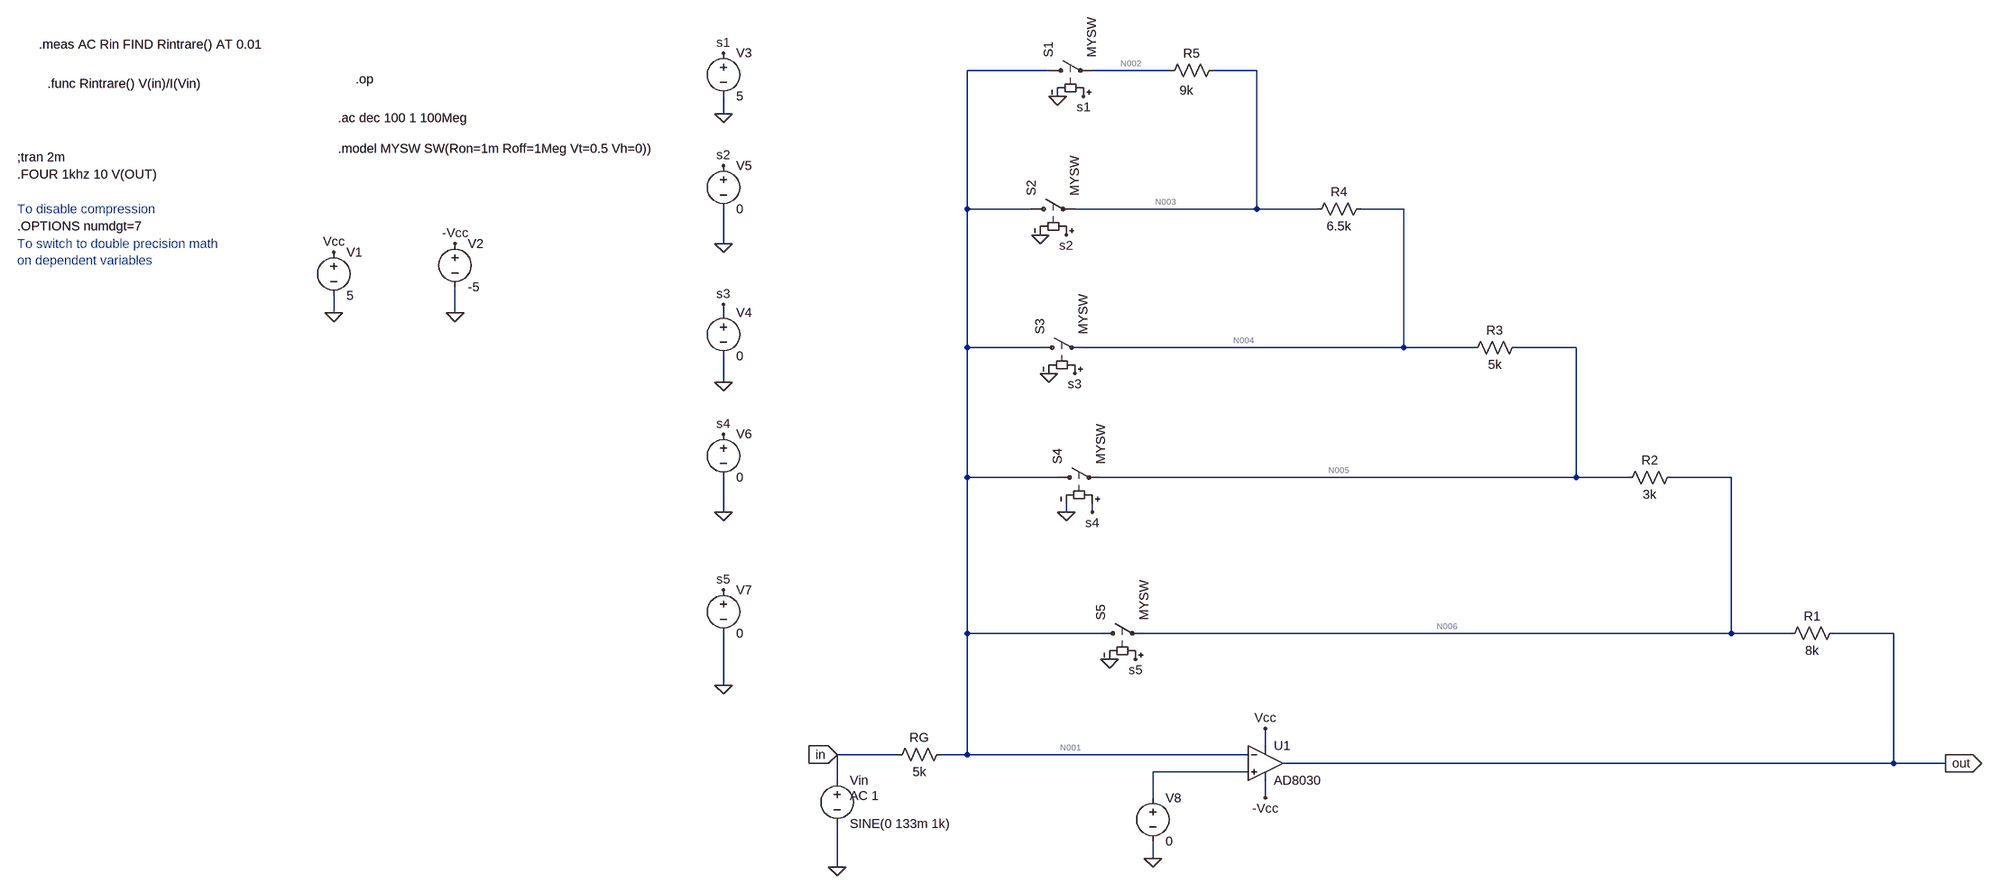
[diagram p0: schematic etaj3_.asc]
etaj3_.asc, the LTspice schematic file:
Version 4
SHEET 1 880 888
WIRE -1808 -5536 -2096 -5536
WIRE -1584 -5536 -1728 -5536
WIRE -1424 -5536 -1504 -5536
WIRE -2656 -5456 -2656 -5488
WIRE -2096 -5280 -2096 -5536
WIRE -1840 -5280 -2096 -5280
WIRE -1424 -5280 -1424 -5536
WIRE -1424 -5280 -1760 -5280
WIRE -1312 -5280 -1424 -5280
WIRE -1152 -5280 -1232 -5280
WIRE -2656 -5216 -2656 -5280
WIRE -3616 -5088 -3616 -5120
WIRE -3392 -5088 -3392 -5136
WIRE -2656 -5088 -2656 -5104
WIRE -2096 -5024 -2096 -5280
WIRE -1824 -5024 -2096 -5024
WIRE -1152 -5024 -1152 -5280
WIRE -1152 -5024 -1744 -5024
WIRE -1024 -5024 -1152 -5024
WIRE -832 -5024 -944 -5024
WIRE -2656 -4960 -2656 -5008
WIRE -2096 -4784 -2096 -5024
WIRE -1792 -4784 -2096 -4784
WIRE -832 -4784 -832 -5024
WIRE -832 -4784 -1712 -4784
WIRE -736 -4784 -832 -4784
WIRE -512 -4784 -656 -4784
WIRE -2656 -4720 -2656 -4784
WIRE -1776 -4720 -1776 -4736
WIRE -1728 -4720 -1728 -4736
WIRE -2096 -4496 -2096 -4784
WIRE -1712 -4496 -2096 -4496
WIRE -512 -4496 -512 -4784
WIRE -512 -4496 -1632 -4496
WIRE -336 -4496 -512 -4496
WIRE -96 -4496 -256 -4496
WIRE -2656 -4400 -2656 -4496
WIRE -1408 -4288 -1408 -4320
WIRE -2224 -4272 -2336 -4272
WIRE -2096 -4272 -2096 -4496
WIRE -2096 -4272 -2144 -4272
WIRE -1440 -4272 -2096 -4272
WIRE -96 -4256 -96 -4496
WIRE -96 -4256 -1376 -4256
WIRE 0 -4256 -96 -4256
WIRE -1440 -4240 -1616 -4240
WIRE -2336 -4224 -2336 -4272
WIRE -1616 -4192 -1616 -4240
WIRE -1408 -4192 -1408 -4224
WIRE -1616 -4080 -1616 -4112
WIRE -2336 -4064 -2336 -4144
FLAG -2336 -4064 0
FLAG -3616 -5088 0
FLAG -3392 -5088 0
FLAG -3392 -5216 -Vcc
FLAG -3616 -5200 Vcc
FLAG -2656 -5456 0
FLAG -2656 -4720 0
FLAG -2656 -4400 0
FLAG -2656 -5216 0
FLAG -2656 -5568 s1
FLAG -2656 -5360 s2
FLAG -2656 -5104 s3
FLAG -2656 -4864 s4
FLAG -2656 -4576 s5
FLAG -2656 -4960 0
FLAG -1792 -5488 0
FLAG -1744 -5488 s1
FLAG -1824 -5232 0
FLAG -1776 -5232 s2
FLAG -1808 -4976 0
FLAG -1760 -4976 s3
FLAG -1776 -4720 0
FLAG -1728 -4720 s4
FLAG -1696 -4448 0
FLAG -1648 -4448 s5
FLAG 0 -4256 out
IOPIN 0 -4256 Out
FLAG -1408 -4320 Vcc
FLAG -1408 -4192 -Vcc
FLAG -2336 -4272 in
IOPIN -2336 -4272 In
FLAG -1616 -4080 0
SYMBOL res -1488 -5552 R90
WINDOW 0 0 56 VBottom 2
WINDOW 3 37 66 VTop 2
SYMATTR InstName R5
SYMATTR Value 9k
SYMBOL res -1216 -5296 R90
WINDOW 0 0 56 VBottom 2
WINDOW 3 32 56 VTop 2
SYMATTR InstName R4
SYMATTR Value 6.5k
SYMBOL res -928 -5040 R90
WINDOW 0 0 56 VBottom 2
WINDOW 3 32 56 VTop 2
SYMATTR InstName R3
SYMATTR Value 5k
SYMBOL res -640 -4800 R90
WINDOW 0 0 56 VBottom 2
WINDOW 3 32 56 VTop 2
SYMATTR InstName R2
SYMATTR Value 3k
SYMBOL res -240 -4512 R90
WINDOW 0 0 56 VBottom 2
WINDOW 3 32 56 VTop 2
SYMATTR InstName R1
SYMATTR Value 8k
SYMBOL res -2128 -4288 R90
WINDOW 0 0 56 VBottom 2
WINDOW 3 32 56 VTop 2
SYMATTR InstName RG
SYMATTR Value 5k
SYMBOL voltage -2336 -4240 R0
WINDOW 123 24 44 Left 2
WINDOW 39 0 0 Left 0
SYMATTR Value2 AC 1
SYMATTR InstName Vin
SYMATTR Value SINE(0 133m 1k)
SYMBOL voltage -3616 -5216 R0
WINDOW 123 0 0 Left 0
WINDOW 39 0 0 Left 0
SYMATTR InstName V1
SYMATTR Value 5
SYMBOL voltage -3392 -5232 R0
WINDOW 123 0 0 Left 0
WINDOW 39 0 0 Left 0
SYMATTR InstName V2
SYMATTR Value -5
SYMBOL voltage -2656 -5584 R0
WINDOW 123 0 0 Left 0
WINDOW 39 0 0 Left 0
SYMATTR InstName V3
SYMATTR Value 5
SYMBOL voltage -2656 -5104 R0
WINDOW 123 0 0 Left 0
WINDOW 39 0 0 Left 0
SYMATTR InstName V4
SYMATTR Value 0
SYMBOL voltage -2656 -5376 R0
WINDOW 123 0 0 Left 0
WINDOW 39 0 0 Left 0
SYMATTR InstName V5
SYMATTR Value 0
SYMBOL voltage -2656 -4880 R0
WINDOW 123 0 0 Left 0
WINDOW 39 0 0 Left 0
SYMATTR InstName V6
SYMATTR Value 0
SYMBOL voltage -2656 -4592 R0
WINDOW 123 0 0 Left 0
WINDOW 39 0 0 Left 0
SYMATTR InstName V7
SYMATTR Value 0
SYMBOL sw -1824 -5536 R270
SYMATTR InstName S1
SYMATTR Value MYSW
SYMBOL sw -1856 -5280 R270
SYMATTR InstName S2
SYMATTR Value MYSW
SYMBOL sw -1840 -5024 R270
SYMATTR InstName S3
SYMATTR Value MYSW
SYMBOL sw -1808 -4784 R270
SYMATTR InstName S4
SYMATTR Value MYSW
SYMBOL sw -1728 -4496 R270
SYMATTR InstName S5
SYMATTR Value MYSW
SYMBOL OpAmps\\AD8030 -1408 -4320 R0
SYMATTR InstName U1
SYMBOL voltage -1616 -4208 R0
WINDOW 123 0 0 Left 0
WINDOW 39 0 0 Left 0
SYMATTR InstName V8
SYMATTR Value 0
TEXT -3608 -5448 Left 2 !.ac dec 100 1 100Meg
TEXT -3608 -5392 Left 2 !.model MYSW SW(Ron=1m Roff=1Meg Vt=0.5 Vh=0))
TEXT -3576 -5520 Left 2 !.op
TEXT -5024 -5584 Left 2 !.meas AC Rin FIND Rintrare() AT 0.01
TEXT -5008 -5512 Left 2 !.func Rintrare() V(in)/I(Vin)
TEXT -5064 -5376 Left 2 !;tran 2m
TEXT -5064 -5280 Left 2 ;To disable compression
TEXT -5064 -5248 Left 2 !.OPTIONS numdgt=7
TEXT -5064 -5216 Left 2 ;To switch to double precision math\non dependent variables
TEXT -5064 -5344 Left 2 !.FOUR 1khz 10 V(OUT)

The netlist it stands for:
* etaj3_.asc
R5 N003 N002 9k
R4 N004 N003 6.5k
R3 N005 N004 5k
R2 N006 N005 3k
R1 out N006 8k
RG N001 in 5k
Vin in 0 SINE(0 133m 1k) AC 1
V1 Vcc 0 5
V2 -Vcc 0 -5
V3 s1 0 5
V4 s3 0 0
V5 s2 0 0
V6 s4 0 0
V7 s5 0 0
S1 N001 N002 s1 0 MYSW
S2 N001 N003 s2 0 MYSW
S3 N001 N004 s3 0 MYSW
S4 N001 N005 s4 0 MYSW
S5 N001 N006 s5 0 MYSW
XU1 N007 N001 Vcc -Vcc out AD8040  ; AD8030, pins In+ In- V+ V- OUT
V8 N007 0 0
.ac dec 100 1 100Meg
.model MYSW SW(Ron=1m Roff=1Meg Vt=0.5 Vh=0))
.op
.meas AC Rin FIND Rintrare() AT 0.01
.func Rintrare() V(in)/I(Vin)
;tran 2m
* To disable compression
.OPTIONS numdgt=7
* To switch to double precision math
* on dependent variables
.FOUR 1khz 10 V(OUT)
.lib ADI.lib
.backanno
.end

* Results of the author's LTspice run, read from the files saved beside the schematic
* Operating Point, zero values left out:
*   V(n003) = -14.31 mV
*   V(n002) = 533.1 nV
*   V(n004) = -24.74 mV
*   V(n005) = -32.88 mV
*   V(n006) = -37.87 mV
*   V(out) = -51.47 mV
*   V(n001) = 534.7 nV
*   V(vcc) = 5 V
*   V(-vcc) = -5 V
*   V(s1) = 5 V
*   I(Rg) = 106.9 pA
*   I(R1) = -1.7 µA
*   I(R2) = -1.662 µA
*   I(R3) = -1.629 µA
*   I(R4) = -1.604 µA
*   I(R5) = -1.59 µA
*   I(S5) = -37.87 nA
*   I(S4) = -32.89 nA
*   I(S3) = -24.74 nA
*   I(S2) = -14.31 nA
*   I(S1) = -1.59 µA
*   I(V8) = 1.7 µA
*   I(V2) = 1.303 mA
*   I(V1) = -1.305 mA
*   I(Vin) = 106.9 pA
*   Ix(u1:1) = -1.7 µA
*   Ix(u1:2) = -1.7 µA
*   Ix(u1:3) = 1.305 mA
*   Ix(u1:4) = -1.303 mA
*   Ix(u1:5) = 1.7 µA
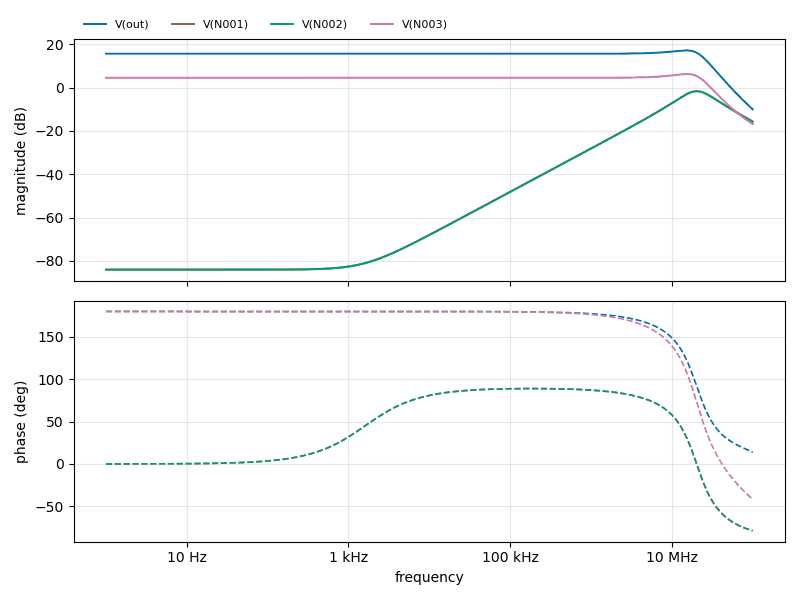
[diagram p1: AC Analysis of etaj3_.asc, plotted from the saved traces]
* AC Analysis, 1 run:
*   V(out): 15.64 dB at 1 Hz, -10.04 dB at 100 MHz, peak 17.19 dB at 15.14 MHz, 3 dB below the peak at 23.99 MHz
*   V(N001): -84.04 dB at 1 Hz, -15.68 dB at 100 MHz, peak -1.65 dB at 20.42 MHz, 3 dB below the peak at 12.76 MHz and 32.25 MHz
*   V(N002): -84.06 dB at 1 Hz, -15.68 dB at 100 MHz, peak -1.65 dB at 20.42 MHz, 3 dB below the peak at 12.76 MHz and 32.25 MHz
*   V(N003): 4.52 dB at 1 Hz, -16.82 dB at 100 MHz, peak 6.28 dB at 15.49 MHz, 3 dB below the peak at 24.53 MHz
* From the log:
*   Semiconductor Device Operating Points:
*                           --- Diodes ---
*   Name:    d:u1:2      d:u1:8      d:u1:1      d:u1:7      d:u1:4
*   Model:    u1:bb      u1:ed2       u1:aa      u1:bias     u1:bias
*   Id:      6.81e-17    5.35e-19    1.70e-06    1.70e-06    1.70e-06
*   Vd:      6.80e-05    5.35e-07    6.80e-05    5.00e+00    5.00e+00
*   Req:     1.00e-12    1.00e-12    2.50e-02    2.00e-05    2.00e-05
*   CAP:     0.00e+00    0.00e+00    0.00e+00    0.00e+00    0.00e+00
*   Name:    d:u1:3      d:u1:6      d:u1:5      d:u1:22     d:u1:21
*   Model:    u1:iq       u1:x1       u1:x1      u1:esd      u1:esd
*   Id:      1.25e-03   -4.95e-05   -5.05e-05   -5.01e-12   -5.00e-12
*   Vd:      1.00e+01   -4.95e+00   -5.05e+00   -5.00e+00   -5.00e+00
*   Req:     1.00e-03    1.00e-05    1.00e-05    1.00e-12    1.00e-12
*   CAP:     0.00e+00    0.00e+00    0.00e+00    0.00e+00    0.00e+00
*   Note: .fourier statements are only valid with a .tran command.
*         No Fourier analysis performed.
*   rin: rintrare()=(73.9799dB,-180°) at 0.01